# EAGLE design 2DD-20-mk-1.0.0 (EAGLE 7.5.0)
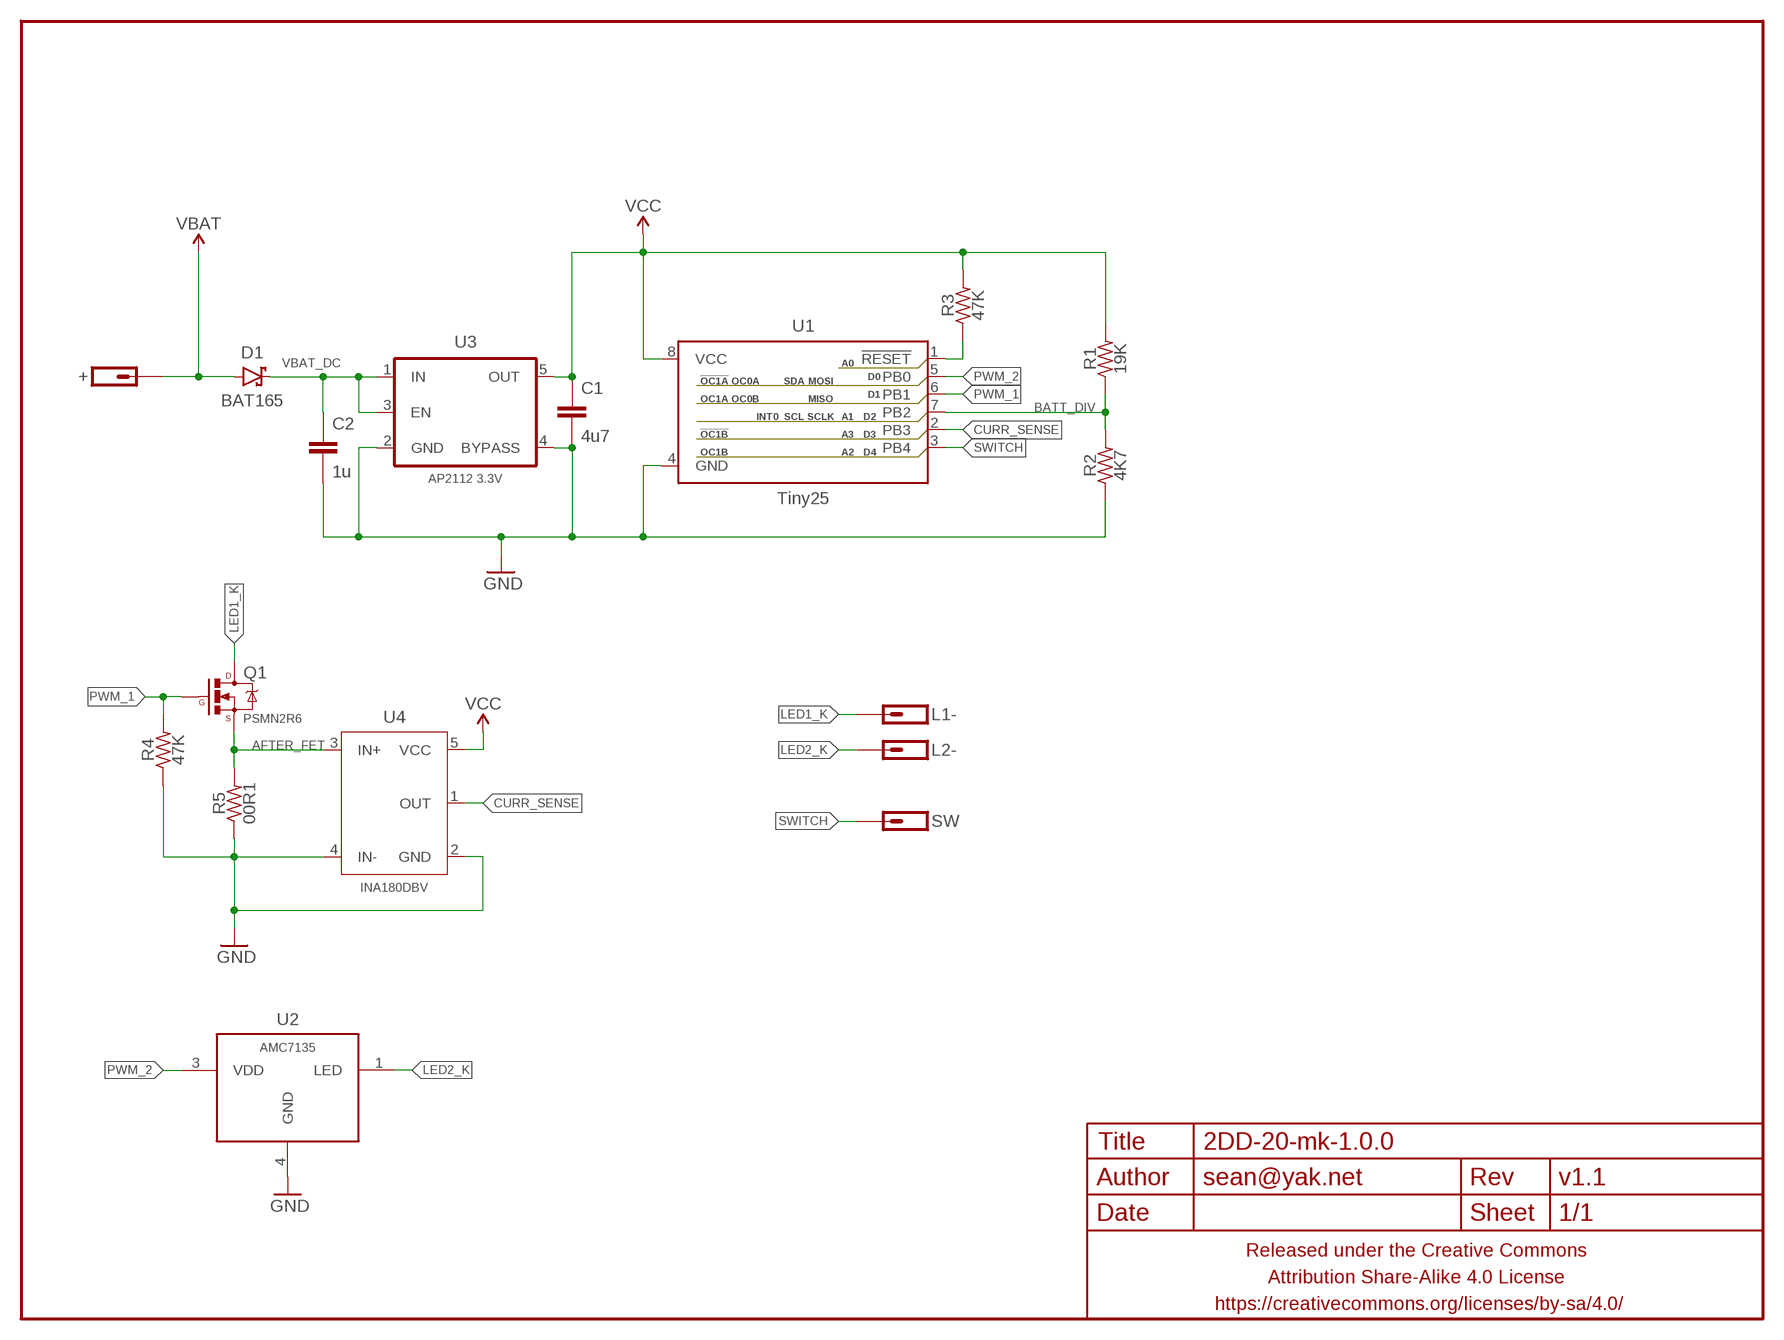
[diagram p0: schematic, sheet 1]

## Parts
+  M01PTH-1MM-CIR-NS  [1X01-1MM-CIR-NS]
C1  4u7  CAPACITOR-CERAMICC0603-TIGHTER  [C0603-TIGHTER]
C2  1u  CAPACITOR-CERAMICC0402  [C0402]
D1  BAT165  DIODE-SCHOTTKYSOD323  [SOD323-SCHOTTKY]
FRAME1  FRAME-LETTERNO_PACKAGE  [DUMMY]
L1-  M011X01-0.9MM-CIR  [1X01-0.9MM-CIR]
L2-  M01PTH-0.8MM-CIR  [1X01-0.8MM-CIR]
Q1  PSMN2R6  MOSFET-NCHANNELSIR800DP  [POWERPACK-SO-8]
R1  19K  RESISTORR0402  [R0402]
R2  4K7  RESISTORR0402  [R0402]
R3  47K  RESISTORR0402  [R0402]
R4  47K  RESISTORR0402  [R0402]
R5  00R1  RESISTORR1206  [R1206]
SW  M01SMD-0.8MM-DIA-NS  [1X01-SMD-0.8MM-DIA-NS]
U1  Tiny25  ATTINY13SOIC-NARROWPADS  [SO08-NARROWER]
U2  AMC7135  AMC7135SOT-89-NOTHERM-ROUNDED-LESS  [SOT89-NOTHERM-ROUNDED-LESS]
U3  AP2112 3.3V  V_REG_SOT-23-5AP2112  [SOT23-5]
U4  INA180DBV  [SOT23-5]

## Nets
AFTER_FET: Q1.1(S) Q1.2(S) Q1.3(S) R5.2 U4.3(IN+)
BATT_DIV: R1.1 R2.2 U1.7(PB2)
CURR_SENSE: U1.2(PB3) U4.1(OUT)
GND: C1.2 C2.2 R2.1 R4.1 R5.1 U1.4(GND) U2.4(GND) U3.2(GND) U3.4(BYPASS) U4.2(GND) U4.4(IN-)
LED1_K: L1-.P$1 Q1.5678(D)
LED2_K: L2-.1 U2.1(LED)
N$1: R3.1 U1.1(!RESET)
PWM_1: Q1.4(G) R4.2 U1.6(PB1)
PWM_2: U1.5(PB0) U2.3(VDD)
SWITCH: SW.P$1 U1.3(PB4)
VBAT: +.1 D1.A
VBAT_DC: C2.1 D1.C U3.1(IN) U3.3(EN)
VCC: C1.1 R1.2 R3.2 U1.8(VCC) U3.5(OUT) U4.5(VCC)

## Library data of the parts
+ L1- L2- SW = a_parts:M01: Header 1 Standard 1-pin 0.1" header. Use with straight break away headers (SKU : PRT-00116), right angle break away headers (PRT-00553), swiss pins (PRT-00743), machine pins (PRT-00117), and female headers (PRT-00115).
C1 C2 = a_parts:CAPACITOR-CERAMIC: CAPACITOR, European symbol
D1 = a_parts:DIODE-SCHOTTKY: Schottky diodes in SFE's production catalog BAT20J 1A 23V 0.62Vf RB751 120mA 40V 0.37Vf PMEG4005EJ 0.5A 40V 0.42Vf MBRA140 1A 40V 0.5Vf B340A 3A 40V SMA
FRAME1 = a_parts:FRAME-LETTER: Schematic Frame Standard 8.5x11 US Letter frame; DESIGNER: sean@yak.net; VERSION: v1.1
Q1 = a_parts:MOSFET-NCHANNEL: Common NMOSFET Parts MFG P/N Store ID Prod ID FDD8780 TRANS-09984 SI7820DN TRANS-11055 FDS6630A IC-08089 2N7002PW TRANS-11151 FQP30N06L COM-10213 TRANS-10060 BSS123LT1G TRANS-08345 BSS138 TRANS-00830 BS170 2N7000
R1-R5 = a_parts:RESISTOR: RESISTOR, American symbol
U1 = a_parts:ATTINY13: Atmel 8-pin 1kB flash uC
U2 = a_parts:AMC7135
U3 = a_parts:V_REG_SOT-23-5
U4 = a_parts:INA180

## Board
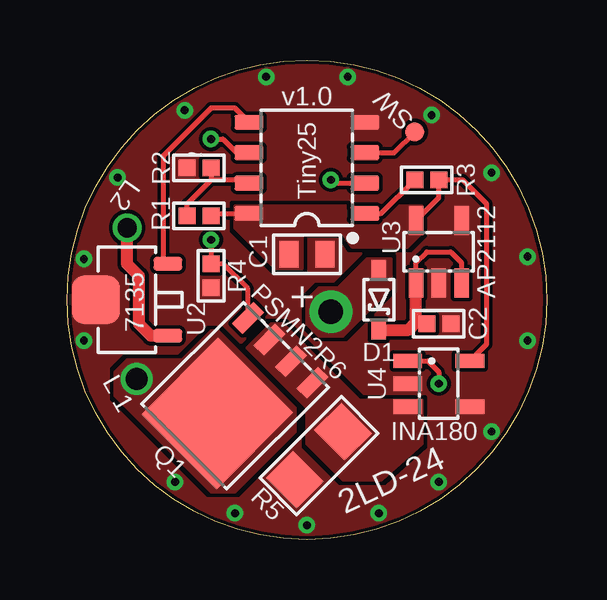
[diagram p1: board, top side]
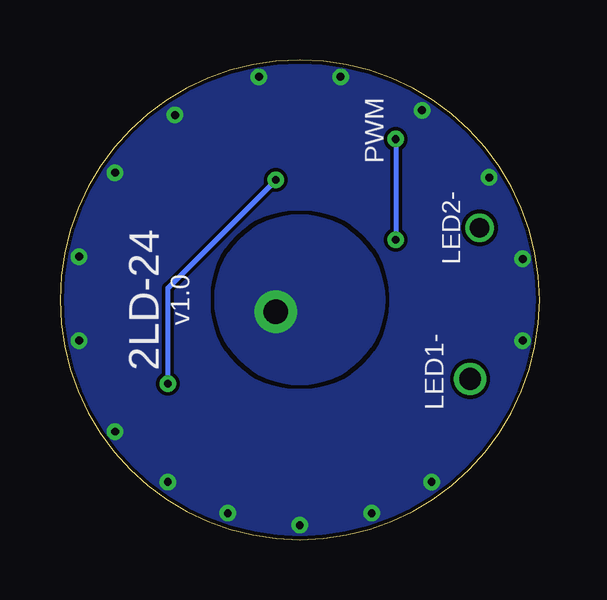
[diagram p2: board, bottom side, seen from below]

Size 20 x 20 mm. Coordinates in mm from the lower left corner, seen from the top.
Outline: 0,10 arc-180 20,10 arc-180 0,10
Copper layers (1*16): Top 0.0356mm / dielectric 1.5011mm / Bottom 0.0356mm
Design rules "LaenPCBOrder2": minimum track width 6mil, minimum drill 13mil, track to track 6mil, track to pad 6mil, pad to pad 6mil, via to via 6mil, smd to smd 6mil, copper to edge 6mil, drill to drill 6mil, minimum pad ring 7mil, minimum via ring 7mil, stop-mask expansion 3mil, vias tented up to drill 20mil, thermal gap 10mil

### Footprints (pad centres in the part's own frame; a part is rotated, then mirrored left to right if it is on the bottom)
1X01-1MM-CIR-NS = drill 1.016 pad 1.778: 1 0,0
C0603-TIGHTER = smd 0.8 x 1.1: 1 -0.75,0; 2 0.75,0
C0402 = smd 0.7 x 0.7: 1 -0.5,0; 2 0.5,0
SOD323-SCHOTTKY = smd 0.8 x 0.6: A -1.25,0; C 1.25,0
1X01-0.9MM-CIR = drill 0.9 pad 1.3: P$1 0,0
1X01-0.8MM-CIR = drill 0.8: 1 0,0
POWERPACK-SO-8 = smd 1.27 x 0.61: 1 -2.67,1.905; 2 -2.67,0.635; 3 -2.67,-0.635; 4 -2.67,-1.905 | smd 4.52 x 4.42: 5678 1.045,0
R0402 = smd 0.7 x 0.7: 1 -0.5,0; 2 0.5,0
R1206 = smd 1.6 x 1.8: 1 -1.42,0; 2 1.42,0
1X01-SMD-0.8MM-DIA-NS = smd 0.8 x 0.8: P$1 0,0
SO08-NARROWER = smd 0.6 x 1.2: 1 -1.905,-2.416; 2 -0.635,-2.416; 3 0.635,-2.416; 4 1.905,-2.416; 5 1.905,2.416; 6 0.635,2.416; 7 -0.635,2.416; 8 -1.905,2.416
SOT89-NOTHERM-ROUNDED-LESS = smd 0.58 x 1.2: 1 -1.5,-1.7; 3 1.5,-1.7 | smd 2 x 2: 4 0,1.3
SOT23-5 = smd 0.6 x 1.2: 1 -0.95,-1.3; 2 0,-1.3; 3 0.95,-1.3; 4 0.95,1.3; 5 -0.95,1.3

### Placement (x,y rotation side)
+  11,9.5 90 top
C1  10,11.9 0 top
C2  15.5,9 0 top
D1  13,10 270 top
FRAME1  0,0 0 top
L1-  2.9,6.7 270 top
L2-  2.5,13 90 top
Q1  7,6 225 top
R1  5.5,13.5 0 top
R2  5.5,15.5 0 top
R3  15,15 0 top
R4  6,11 90 top
R5  10.5,3.5 45 top
SW  14.5,17 0 top
U1  10,15.5 90 top
U2  2.5,10 90 top
U3  15.5,12 0 top
U4  15.5,6.5 270 top

### Tracks (layer width: path | path; a pad name or v marks a point on that pad's centre or on a via)
AFTER_FET
  pour Top (isolate 0.152, rank 2, no thermals): 8.5,9 7.5,8 10,5.5 10,4 11.5,2.5 13.1,2.5 14.8,4 14.8,5.8 12.2,5.8 9,9
BATT_DIV
  Top 0.2: R1.1 5,14 6,15 | R2.2 6,15 | U1.7 7.45,15 6,15
CURR_SENSE  (via drill 0.33)
  Top 0.2: U4.1 15.05,7.45 15.5,7 v15.5,6.5 | v11,15 11.13,14.87 U1.2
  Bottom 0.2: v15.5,6.5 15.5,10.5 v11,15
GND  (via drill 0.33)
  other vias: 8.3,19.3 11.7,19.3 4.9,17.9 17.7,15.3 15.2,17.7 19.2,11.8 19.2,8.3 17.7,4.5 13,1.1 10,0.6 7,1.1 4.5,2.4 0.7,8.3 0.7,11.7 2.1,15.1 15.5,2.4
  pour Top (isolate 0.152, rank 6, no thermals): 0,10 arc90 10,0 arc90 20,10 arc90 10,20 arc90
  pour Bottom (isolate 0.152, rank 6, no thermals): 20,10 arc-90 10,0 arc-90 0,10 arc-90 10,20 arc-90
LED1_K
  pour Top (isolate 0.152, rank 2, no thermals): 2.5,7.5 4.8,7.5 6,8.7 6.3,8.7 9.5,5.5 9.5,4.5 7,2 6,2 2,6 2,7
LED2_K
  Top 0.5: U2.1 3.5,8.5 3,9 3,11 2.5,11.5 L2-.1
N$1
  Top 0.2: U1.1 13.1,13.6 R3.1
PWM_1  (via drill 0.33)
  Top 0.2: v6,12.5 R4.2 6.5,11.5 7.54,10.46 Q1.4 | v6,16.7 6.5,16.7 7.07,16.14 U1.6
  Bottom 0.2: v6,16.7 v6,12.5
PWM_2
  Top 0.2: U1.5 7,18 6,18 4,16 4,11.5 U2.3
SWITCH
  Top 0.2: U1.3 13.63,16.14 SW.P$1
VBAT
  pour Bottom (isolate 0.152, no thermals): 6.5,10 arc-180 13.5,10 arc-180
  pour Top (isolate 0.152, rank 2, no thermals): 10.5,10.5 10,10 10,9 10.5,8.5 11.5,8.5 13.5,10.5 13.5,11.7 12.5,11.7 11.3,10.5
VBAT_DC
  Top 0.2: U3.1 14.55,11.55 15,12 16,12 16.45,11.55 U3.3
  Top 0.5: 14.55,10.3 U3.1 14.55,9.05 | D1.C 14.25,8.75 14.55,9.05 | C2.1 14.95,9.05 14.55,9.05
VCC
  Top 0.2: R1.2 6.09,13.6 U1.8 | U3.5 15.5,14.25 R3.2 16.5,15 17.5,14 17.5,8.15 U4.5
  pour Top (isolate 0.152, rank 2, no thermals): 7,13.9 14.8,13.9 14.8,12.8 14.2,12.2 11.9,12.2 11.5,12.8 9.8,12.8 9.8,11.3 8.7,11.3 7,13

### Text on the board
tPlace: ~ | AP2112 | 7135 | INA180 | 2LD-24
bPlace: PWM | LED2- | 2LD-24 | LED1-
tNames: L2 | L | 1